# Altium schematic sheet MIC.SchDoc
size A4; Organization: Altium Limited; Address1: L3, 12a Rodborough Rd; Address2: Frenchs Forest; Address3: NSW; Address4: Australia 2086
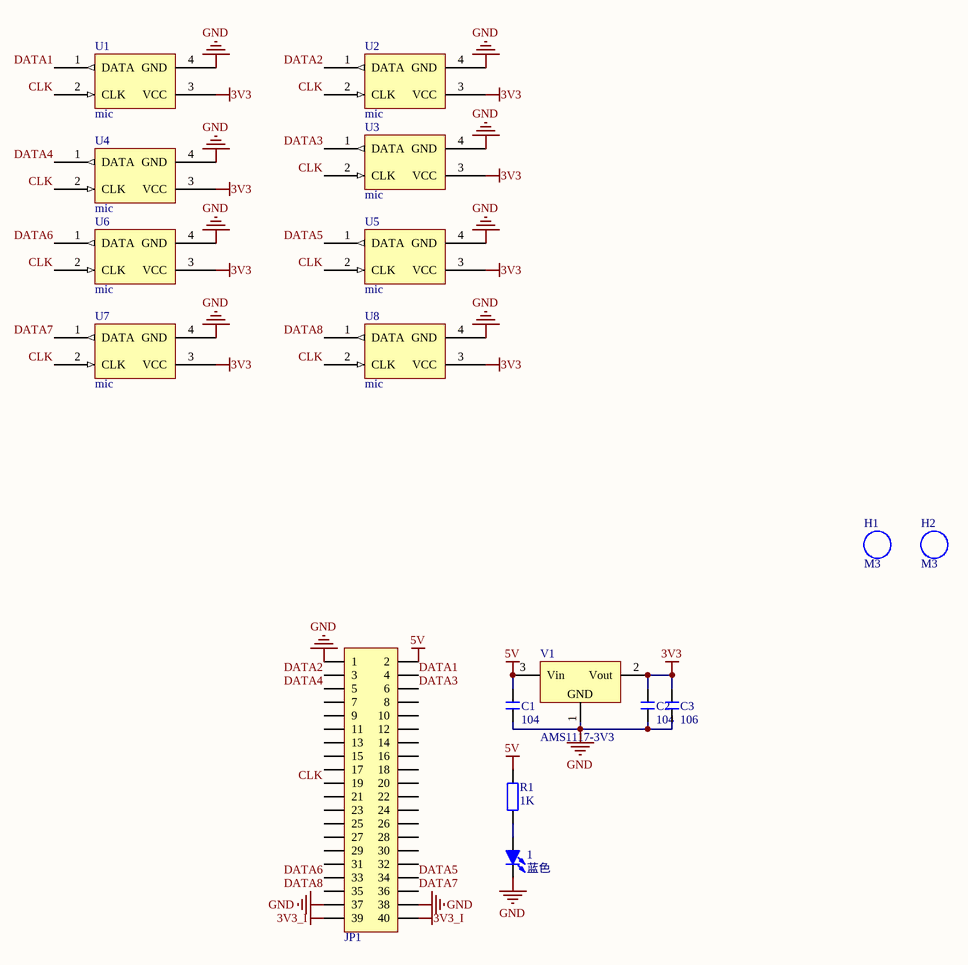
[diagram p0: MIC.SchDoc]

## Parts
1  蓝色  [LED 0603B]
C1  104  [C 0603_L]
C2  104  [C 0603_L]
C3  106  [C 0805_M]
H1  M3  [M3 125X200]
H2  M3  [M3 125X200]
JP1  Header 2X11  [HDR2.54-LI-2x20P]  (value not drawn)
R1  1K  [R 0603_L]
U1  mic  [SDM6601]
U2  mic  [SDM6601]
U3  mic  [SDM6601]
U4  mic  [SDM6601]
U5  mic  [SDM6601]
U6  mic  [SDM6601]
U7  mic  [SDM6601]
U8  mic  [SDM6601]
V1  AMS1117-3V3  [SOT223_L]

## Nets
3V3: C2.1 C3.1 U1.3(VCC) U2.3(VCC) U3.3(VCC) U4.3(VCC) U5.3(VCC) U6.3(VCC) U7.3(VCC) U8.3(VCC) V1.2(Vout)
3V3_I: JP1.39 JP1.40
5V: C1.1 JP1.2 R1.1 V1.3(Vin)
GND: 1.2(K) C1.2 C2.2 C3.2 JP1.1 JP1.37 JP1.38 U1.4(GND) U2.4(GND) U3.4(GND) U4.4(GND) U5.4(GND) U6.4(GND) U7.4(GND) U8.4(GND) V1.1(GND)
CLK: JP1.19 U1.2(CLK) U2.2(CLK) U3.2(CLK) U4.2(CLK) U5.2(CLK) U6.2(CLK) U7.2(CLK) U8.2(CLK)
DATA1: JP1.4 U1.1(DATA)
DATA2: JP1.3 U2.1(DATA)
DATA3: JP1.6 U3.1(DATA)
DATA4: JP1.5 U4.1(DATA)
DATA5: JP1.34 U5.1(DATA)
DATA6: JP1.33 U6.1(DATA)
DATA7: JP1.36 U7.1(DATA)
DATA8: JP1.35 U8.1(DATA)
Net1_1: 1.1(A) R1.2

Not connected (* = marked no-connect by the designer): JP1 7 8 9 10 11 12 13 14 15 16 17 18 20 21 22 23 24 25 26 27 28 29 30 31 32

## Notes on the sheet
- Title
- Size:
- Date:
- A4
- Number:
- Time:
- Revision:
- Sheet
- of
- File:

## Library data of the parts
1 = LED-SMD: 贴片LED; 版权归属: 源创客; BOM名称: 贴片LED; 学习资源: www.ooocke.com
C1-C3 = C: 无极性贴片电容; 版权归属: 源创客; BOM名称: 无极性贴片电容; 学习资源: www.ooocke.com
H1 H2 = M3: 铜柱孔; 版权归属: 源创客; BOM名称: 铜柱孔; 学习资源: www.ooocke.com
JP1 = Header 20X2: 20*2P接插件; 版权归属: 源创客; BOM名称: 20*2P接插件; 学习资源: www.ooocke.com
R1 = R: 贴片电阻; 版权归属: 源创客; BOM名称: 贴片电阻; 学习资源: www.ooocke.com
U1-U8 = SDM6601P
V1 = AMS1117: 三端稳压芯片; BOM名称: 稳压芯片; 版权归属: 源创客; 学习资源: www.ooocke.com